# EAGLE design rn2483-moteino (EAGLE 7.3.0)
PROJECT_AUTHOR: xose.perez@gmail.com (tinkerman.cat); PROJECT_LICENSE: GPLv3; PROJECT_NAME: Moteino RN2483 Shield; PROJECT_VERSION: 0.3.20161216
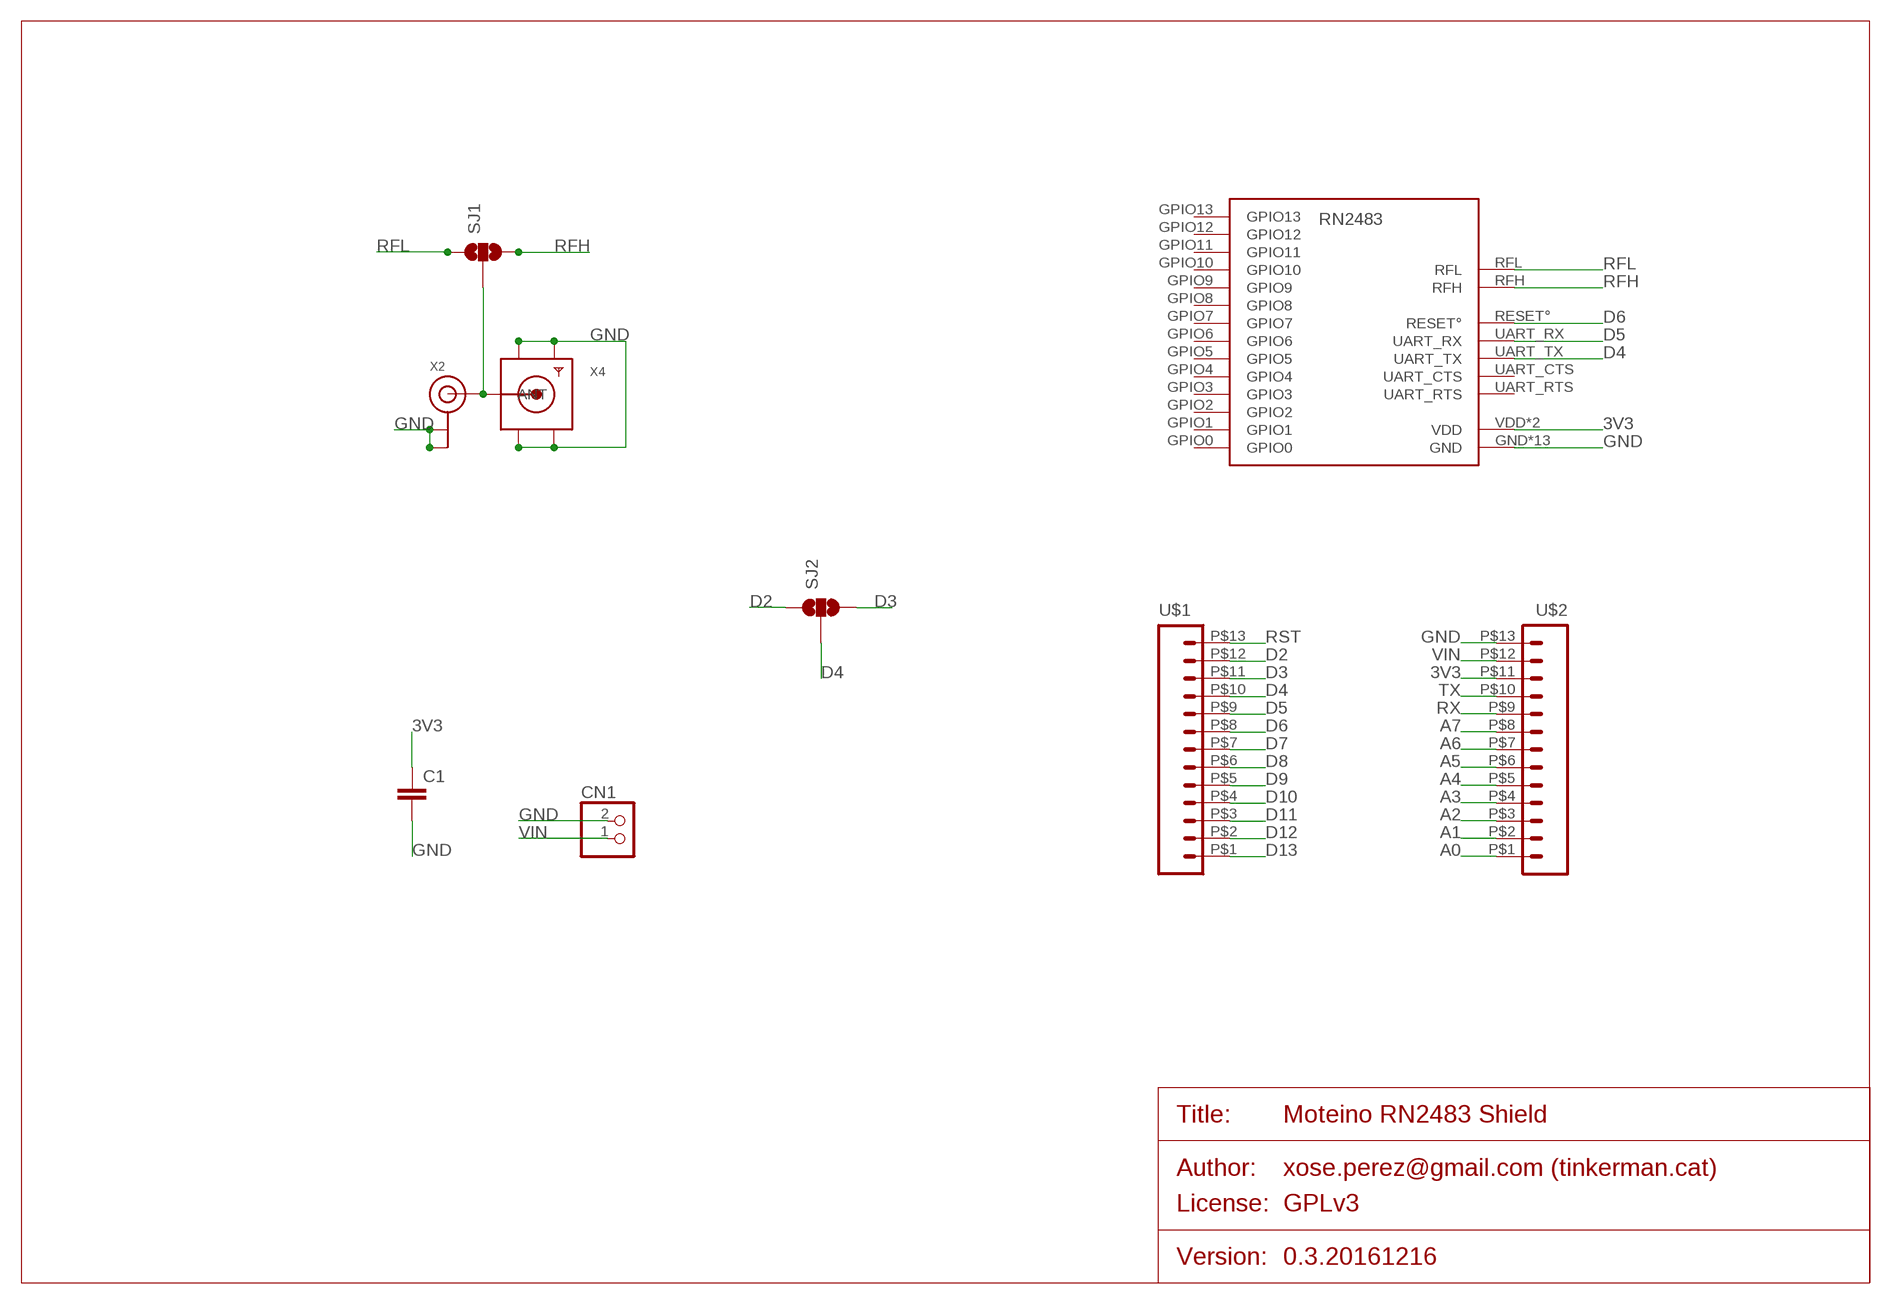
[diagram p0: schematic, sheet 1]

## Parts
C1  C-EU0805  [0805]
CN1  JST_2PIN-SMT-RA  [JST-PH-2-SMT-RA]
RN2483  RN2483ALLPINS  [RN2483]
SJ1  SOLDERJUMPER_2WAYS  [SJ_3]
SJ2  SOLDERJUMPER_2WAYS  [SJ_3]
U$1  M13M13_1X13_SMD  [1X13_SMD]
U$2  M13M13_1X13_SMD  [1X13_SMD]
X2  ANTENNA_U.FL  [U.FL]
X4  SMACONNECTOR_EDGE  [SMA_EDGELAUNCH]

## Nets
3V3: C1.1 RN2483.VDD RN2483.VDD2(VDD) U$2.P$11
A0: U$2.P$1
A1: U$2.P$2
A2: U$2.P$3
A3: U$2.P$4
A4: U$2.P$5
A5: U$2.P$6
A6: U$2.P$7
A7: U$2.P$8
D2: SJ2.1 U$1.P$12
D3: SJ2.3 U$1.P$11
D4: RN2483.UART_TX SJ2.2 U$1.P$10
D5: RN2483.UART_RX U$1.P$9
D6: RN2483.RESET° U$1.P$8
D7: U$1.P$7
D8: U$1.P$6
D9: U$1.P$5
D10: U$1.P$4
D11: U$1.P$3
D12: U$1.P$2
D13: U$1.P$1
GND: C1.2 CN1.2 RN2483.GND RN2483.GND1(GND) RN2483.GND2(GND) RN2483.GND3(GND) RN2483.GND4(GND) RN2483.GND5(GND) RN2483.GND6(GND) RN2483.GND7(GND) RN2483.GND8(GND) RN2483.GND9(GND) RN2483.GND10(GND) RN2483.GND11(GND) RN2483.GND12(GND) U$2.P$13 X2.1(GND) X2.2(GND) X4.GND@1(GND4) X4.GND@2(GND3) X4.GND@3(GND2) X4.GND@4(GND1)
N$2: SJ1.2 X2.3(SIGNAL) X4.P(ANT)
RFH: RN2483.RFH SJ1.3
RFL: RN2483.RFL SJ1.1
RST: U$1.P$13
RX: U$2.P$9
TX: U$2.P$10
VIN: CN1.1 U$2.P$12
Unconnected: RN2483.GPIO0 RN2483.GPIO1 RN2483.GPIO2 RN2483.GPIO3 RN2483.GPIO4 RN2483.GPIO5 RN2483.GPIO6 RN2483.GPIO7 RN2483.GPIO8 RN2483.GPIO9 RN2483.GPIO10 RN2483.GPIO11 RN2483.GPIO12 RN2483.GPIO13 RN2483.UART_CTS RN2483.UART_RTS

## Library data of the parts
C1 = xose:C-EU: CAPACITOR, European symbol
CN1 = adafruit:JST_2PIN: JST 2-Pin Connectors of various flavors SMT-RA (S2B-PH-SM4) 4UConnector #17311 SMT (B2B-PH-SM4) THM-RA (S2B-PH) THM (B2B-PH)
RN2483 = tobias:RN2483: RN2483 Microchip Low-Power Lora Transceiver Module NOT TESTED There are testpads on the bottom of the device. The mask is supposed to cover that, but I have not tested it in practice yet. Info: http://www.microchip.com/wwwproducts/Devices.aspx?product=RN2483 Datasheet: http://ww1.microchip.com/downloads/en/DeviceDoc/50002346B.pdf Adapted from: https://github.com/Octanis1/Octanis1-Electronics/blob/ae493cac28c100e20856abe563dfe8824e9cc4bd/lib/Octanis1.lbr
SJ1 SJ2 = xose:SOLDERJUMPER_2WAY: Solder Jumper 2 way solder jumper
U$1 U$2 = xose:M13
X2 = adafruit:ANTENNA_U.FL: U.FL Antenna Connector
X4 = adafruit:SMACONNECTOR: SMA Connector 90° DIP SMA Connector, 50 Ohm (4UConnector: 07259)

## Board
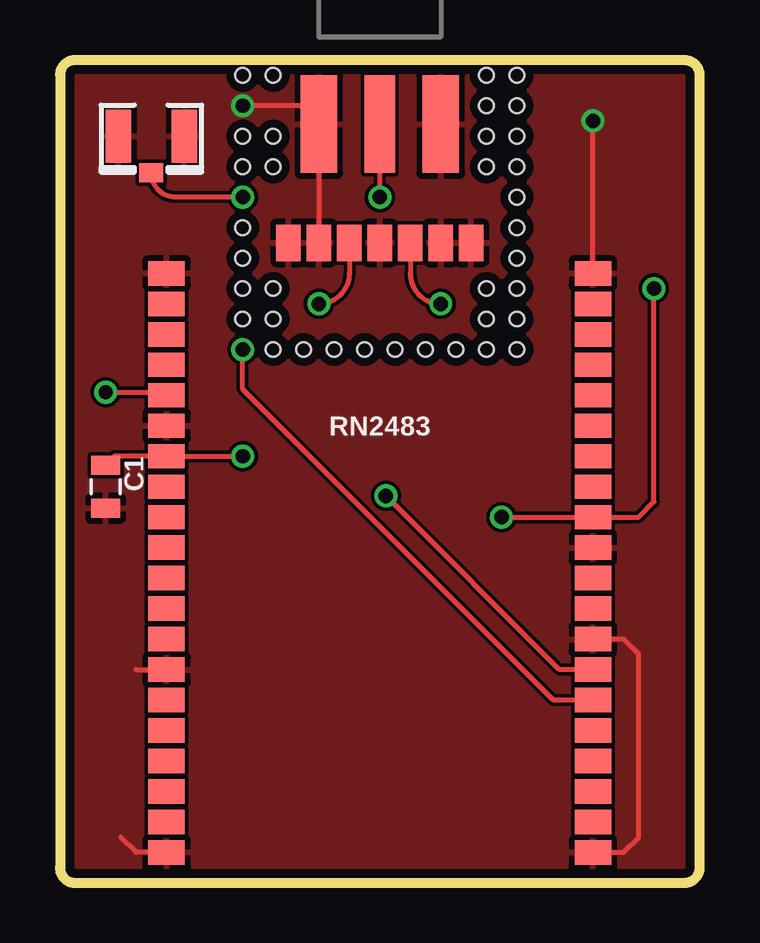
[diagram p1: board, top side]
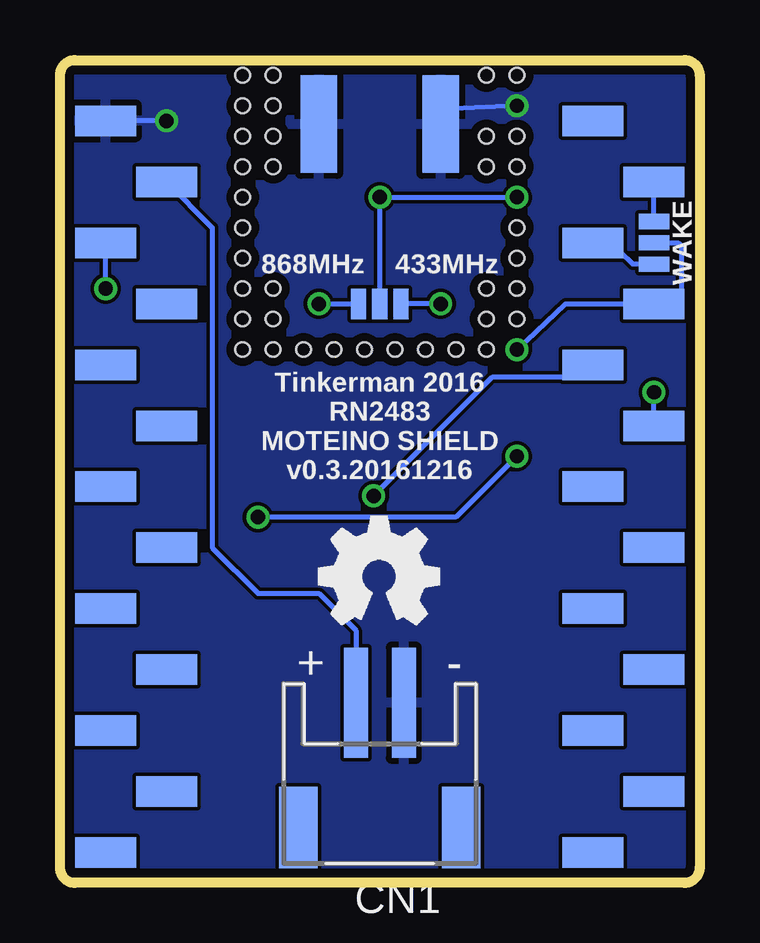
[diagram p2: board, bottom side, seen from below]

Size 26.67 x 34.29 mm. Coordinates in mm from the lower left corner, seen from the top.
Outline: 0,0.64 arc90 0.64,0 26.04,0 arc90 26.67,0.64 26.67,33.66 arc90 26.04,34.29 0.64,34.29 arc90 0,33.66 0,0.64
Copper layers (1*16): Top 0.0356mm / dielectric 1.5011mm / Bottom 0.0356mm
Design rules "oshpark-2layer": minimum track width 6mil, minimum drill 13mil, track to track 6mil, track to pad 6mil, pad to pad 6mil, via to via 6mil, smd to smd 6mil, copper to edge 15mil, drill to drill 6mil, minimum pad ring 7mil, minimum via ring 7mil, stop-mask expansion 2.5mil, vias tented up to drill 0mil, thermal gap 10mil
Holes 0.6 mm at 7.62,26.04 7.62,27.3 7.62,29.84 7.62,31.11 8.89,29.84 17.78,29.84 17.78,31.11 17.78,32.38 19.05,32.38 19.05,31.11 19.05,29.84 19.05,28.57 19.05,27.3 19.05,26.04 19.05,24.77 17.78,24.77 19.05,23.5 17.78,23.5 8.89,24.77 8.89,23.5 8.89,31.11 7.62,23.5 7.62,24.77 8.89,22.23 10.16,22.23 11.43,22.23 12.7,22.23 13.97,22.23 15.24,22.23 16.51,22.23 17.78,22.23 19.05,22.23 8.89,33.66 17.78,33.66 7.62,33.66 19.05,33.66

### Footprints (pad centres in the part's own frame; a part is rotated, then mirrored left to right if it is on the bottom)
0805 = smd 0.8 x 1.2: 1 -0.9,0; 2 0.9,0
JST-PH-2-SMT-RA = smd 1 x 4.6: 1 1,-3.7; 2 -1,-3.7 | smd 1.6 x 3.4: NC1 -3.4,1.5; NC2 3.4,1.5
RN2483 = smd 1.524 x 1.016: GND 17.78,1.27; GND1 17.78,10.16; GND2 17.78,13.97; GND3 17.78,25.4; GND9 0,25.4; GND10 0,19.05; GND11 0,8.89; GND12 0,1.27; GPIO0 0,16.51; GPIO1 0,15.24; GPIO2 0,13.97; GPIO3 0,12.7; GPIO4 0,11.43; GPIO5 0,10.16; GPIO6 0,6.35; GPIO7 0,5.08; GPIO8 0,3.81; GPIO9 0,2.54; GPIO10 17.78,17.78; GPIO11 17.78,16.51; GPIO12 17.78,12.7; GPIO13 17.78,11.43; P$1 0,21.59; P$2 0,22.86; P$3 0,24.13; P$4 17.78,24.13; P$5 17.78,22.86; P$6 17.78,21.59; P$7 17.78,20.32; P$8 17.78,19.05; P$9 17.78,6.35; P$10 17.78,5.08; P$11 0,7.62; RESET° 0,20.32; UART_CTS 17.78,3.81; UART_RTS 17.78,2.54; UART_RX 17.78,8.89; UART_TX 17.78,7.62; VDD 17.78,15.24; VDD2 0,17.78 | smd 1.016 x 1.524: GND4 12.7,26.67; GND5 11.43,26.67; GND6 8.89,26.67; GND7 6.35,26.67; GND8 5.08,26.67; RFH 10.16,26.67; RFL 7.62,26.67
SJ_3 = smd 0.635 x 1.27: 1 -0.889,0; 2 0,0; 3 0.889,0
1X13_SMD = smd 1.27 x 2.54: P$1 0,1.27; P$2 2.54,-1.27; P$3 5.08,1.27; P$4 7.62,-1.27; P$5 10.16,1.27; P$6 12.7,-1.27; P$7 15.24,1.27; P$8 17.78,-1.27; P$9 20.32,1.27; P$10 22.86,-1.27; P$11 25.4,1.27; P$12 27.94,-1.27; P$13 30.48,1.27
U.FL = smd 2.2 x 1.05: 1 0,1.375; 2 0,-1.375 | smd 0.8 x 1: 3 1.525,0
SMA_EDGELAUNCH = smd 4.064 x 1.524: GND@1 2.032,-2.54; GND@2 2.032,2.54 | smd 4.064 x 1.524 bottom: GND@3 2.032,2.54; GND@4 2.032,-2.54 | smd 4.064 x 1.27: P 2.032,0

### Placement (x,y rotation side)
C1  1.91,16.51 270 top
CN1  13.34,3.81 180 bottom
RN2483  4.45,0 0 top
SJ1  13.34,24.13 180 bottom
SJ2  1.91,26.67 270 bottom
U$1  3.17,1.27 90 bottom
U$2  23.5,1.27 90 bottom
X2  3.81,31.11 270 top
X4  13.34,33.66 270 top

### Tracks (layer width: path | path; a pad name or v marks a point on that pad's centre or on a via)
3V3  (via drill 0.6)
  Top 0.203: v7.62,17.78 RN2483.VDD2 2.27,17.78 C1.1 | v18.41,15.24 RN2483.VDD 24.13,15.24 24.77,15.88 v24.77,24.77
  Bottom 0.203: v7.62,17.78 10.16,15.24 v18.41,15.24 | v24.77,24.77 U$2.P$11
D2
  Bottom 0.203: SJ2.1 U$1.P$12
D3
  Bottom 0.203: 4.45,26.86 U$1.P$11 | 4.45,26.22 U$1.P$11 | SJ2.3 2.79,25.78 3.3,26.29 4.06,26.29 U$1.P$11
D4  (via drill 0.6)
  Top 0.203: RN2483.UART_TX 20.57,7.62 7.62,20.57 v7.62,22.23
  Bottom 0.203: SJ2.2 0.89,26.67 0.76,26.54 0.76,24.38 0.89,24.26 1.78,24.26 U$1.P$10 5.59,24.13 v7.62,22.23
D5  (via drill 0.6)
  Top 0.203: RN2483.UART_RX 20.83,8.89 v13.59,16.13
  Bottom 0.203: v13.59,16.13 8.64,21.08 5.59,21.08 U$1.P$9
D6  (via drill 0.6)
  Top 0.203: v1.91,20.45 4.32,20.45 RN2483.RESET°
  Bottom 0.203: U$1.P$8 v1.91,20.45
GND  (via drill 0.6)
  Top 0.203: 4.18,25.66 arc-90 RN2483.GND9 | RN2483.GND 23.5,1.27 24.13,1.91 24.13,9.53 23.5,10.16 RN2483.GND1 | RN2483.GND12 3.17,1.27 2.54,1.91 | 3.17,8.89 RN2483.GND11 | X4.GND@1 10.79,29.84 | RN2483.GND3 v22.23,31.75 | X4.GND@1 RN2483.GND7 | X4.GND@1 10.03,32.38 v7.62,32.38
  Bottom 0.203: v22.23,31.75 U$2.P$13 | v7.62,32.38 10.29,32.26 X4.GND@1
  pour Top: -1.27,-0.64 27.94,-0.64 27.94,35.56 -1.27,35.56
  pour Bottom: -0.64,-0.64 27.3,-0.64 27.3,34.92 -0.64,34.92
N$2  (via drill 0.6)
  Top 0.203: v13.34,28.57 X4.P | v7.62,28.57 4.83,28.57 arc-90 X2.3
  Bottom 0.203: SJ1.2 v13.34,28.57 v7.62,28.57
RFH  (via drill 0.6)
  Top 0.203: RN2483.RFH 14.61,25.4 arc90 v15.88,24.13
  Bottom 0.203: v15.88,24.13 SJ1.3
RFL  (via drill 0.6)
  Top 0.203: RN2483.RFL 12.06,25.4 arc-90 v10.79,24.13
  Bottom 0.203: v10.79,24.13 SJ1.1
VIN
  Bottom 0.203: U$2.P$12 20.32,27.3 20.32,13.97 18.41,12.06 15.88,12.06 14.34,10.53 CN1.1

### Text on the board
bPlace: Tinkerman 2016 / RN2483 / MOTEINO SHIELD / v0.3.20161216
bNames: WAKE | 433MHz | 868MHz